# Altium project PCB_Manchester.PrjPcb
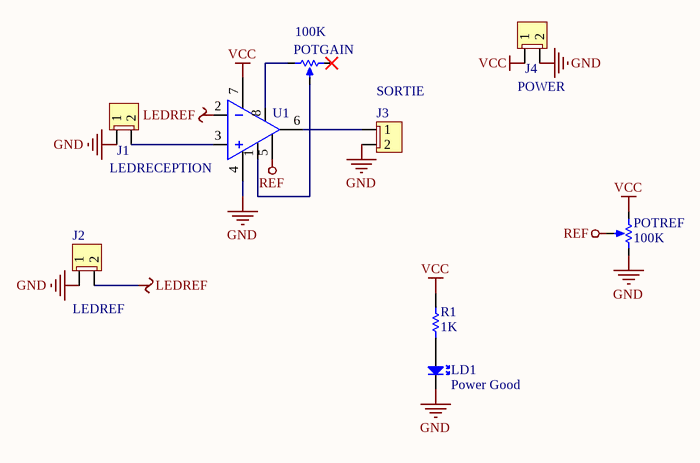
[diagram p0: Manchester.SchDoc]
1 sheet, 9 parts. Net scope: global (net labels, ports and power ports of the same name join across sheets).
Board files: PCB_Manchester.PcbDoc, Manchester_Solo.PcbDoc

## Sheet Manchester.SchDoc
size A4

### Parts
J1  Connector Type: LEDRECEPTION  [MTA100-2]  (hidden comment: Input)
J2  Connector Type: LEDREF  [MTA100-2]  (hidden comment: Input)
J3  Connector Type: SORTIE  [MTA100-2]  (hidden comment: Input)
J4  Connector Type: POWER  [MTA100-2]  (hidden comment: Input)
LD1  Power Good  [LED 3mm Vertical]
POTGAIN  value 100K  [VR1]  (hidden comment: ?????)
POTREF  value 100K  [VR1]  (hidden comment: ?????)
R1  value 1K  [Axial 0.4" Step]  (hidden comment: Res 1/4W)
U1  OpAmp Single  [DIP8]  (value not drawn)

### Nets
GND: J1.1 J2.1 J3.2 J4.2 LD1.2(K) POTREF.3(Bot) U1.4(-Vcc)
LEDREF: J2.2 U1.2(-)
REF: POTREF.2(Tap) U1.5(B)
VCC: J4.1 POTREF.1(Top) R1.1 U1.7(+Vcc)
NetJ1_2: J1.2 U1.3(+)
NetJ3_1: J3.1 U1.6(Out)
NetLD1_1: LD1.1(A) R1.2
NetPOTGAIN_1: POTGAIN.1(Top) U1.8(NC)
NetPOTGAIN_2: POTGAIN.2(Tap) U1.1(B)

Not connected (* = marked no-connect by the designer): POTGAIN 3(Bot)*

### Library data of the parts
J1-J4 = MTA100-2: MTA Male 0 Degres
LD1 = LED 3mm Vertical: Through Hole; Published: 8-Jun-2000; LatestRevisionDate: 08-Jul-2005; LatestRevisionNote: Mech Layer 1 removed.; PackageReference: LED-1; Publisher: Altium Limited; PackageDescription: LED; 2 Leads; Comment_1: LED 3mm Vertical
POTGAIN POTREF = Res Pot 10T Vertical
R1 = Res 1/4W: Resistor; Published: 8-Jun-2000; LatestRevisionDate: 17-Jul-2002; LatestRevisionNote: Re-released for DXP Platform.; PackageReference: AXIAL-0.3; Publisher: Altium Limited; PackageDescription: Axial Device, Thru-Hole; 2 Leads; 0.3 in Pin Spacing